# Altium schematic sheet eeprom.SchDoc
size A4; Engineer: Amir Hossein Jobeiri; Organization: Simaran; SheetNumber: 15; SheetTotal: 24
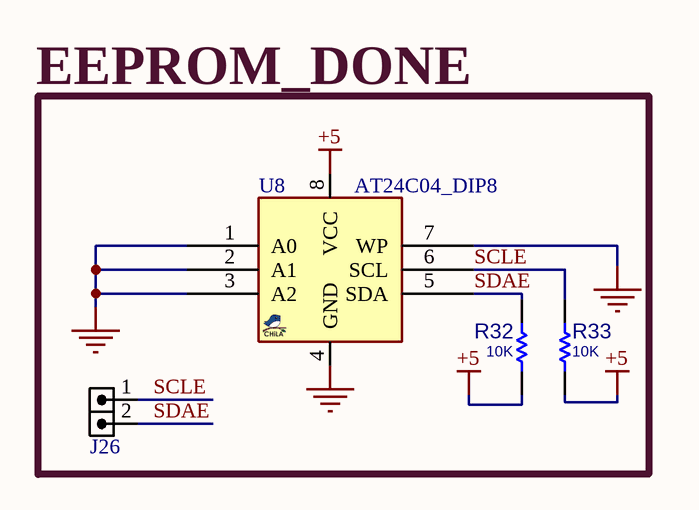
[diagram p0: eeprom.SchDoc]

## Parts
J26  HDRM2  [HDR_M_1X2]  (value not drawn)
R32  10K  [R025W_AX04]
R33  10K  [R025W_AX04]
U8  AT24C04_DIP8  [DIP_8]

## Blocks framed on the sheet
EEPROM_DONE: J26 R32 R33 U8

## Nets
+5: R32.2 R33.2 U8.8(VCC)
GND: U8.1(A0) U8.2(A1) U8.3(A2) U8.4(GND) U8.7(WP)
SCLE: J26.1 R33.1 U8.6(SCL)
SDAE: J26.2 R32.1 U8.5(SDA)

## Library data of the parts
J26 = HDR_M_1X2: CONN, HEADER, Male, pitch: 2.54mm, 2POS; VALUE: HDRM2
R32 R33 = RES_THD: RESISTOR, THD; MANF_P#: RK73H1ETTP4701F; MANF: KOA SPEER; PARAM: 0.063W; DESC: DESCRIPTION; DIST#: MOUSER; PARAM2: 1%; ASSEMBLY: ASSEMBLY; PRICE: 100= 0.5$; VALUE: 10K
U8 = EEPROM_I2C_AT24C04_DIP8: VALUE: AT24C04_DIP8; PARAM: *; PARAM1: *; MANF: *; MANF_P#: *